# Altium schematic sheet Top.SchDoc
size A4
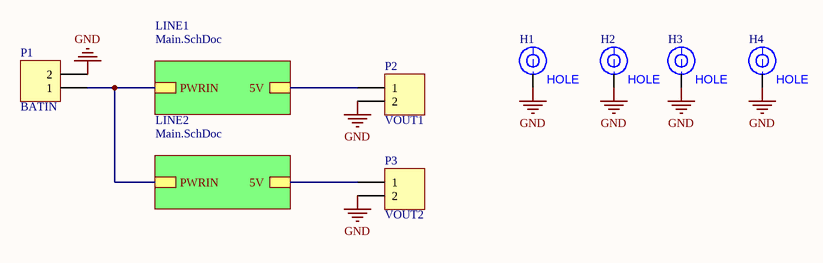
[diagram p0: Top.SchDoc]

## Parts
H1  (no value)  [铜柱-M2]
H2  (no value)  [铜柱-M2]
H3  (no value)  [铜柱-M2]
H4  (no value)  [铜柱-M2]
P1  BATIN  [XT30-HF - HALF]
P2  VOUT1  [XT30-HF - HALF]
P3  VOUT2  [XT30-HF - HALF]

## Sub-sheets
LINE1 = Main.SchDoc: 5V, PWRIN
LINE2 = Main.SchDoc: 5V, PWRIN

## Nets
GND: H1.0 H2.0 H3.0 H4.0 P1.2 P2.2 P3.2
NetP1_1: P1.1 ; sheet LINE1/PWRIN, sheet LINE2/PWRIN
NetP2_1: P2.1 ; sheet LINE1/5V
NetP3_1: P3.1 ; sheet LINE2/5V

## Library data of the parts
H1-H4 = HOLE
P1-P3 = Header 2: Header, 2-Pin; LatestRevisionDate: 17-Jul-2002; LatestRevisionNote: Re-released for DXP Platform.; Publisher: Altium Limited